# EAGLE design motor_driver (EAGLE 8.6.0)
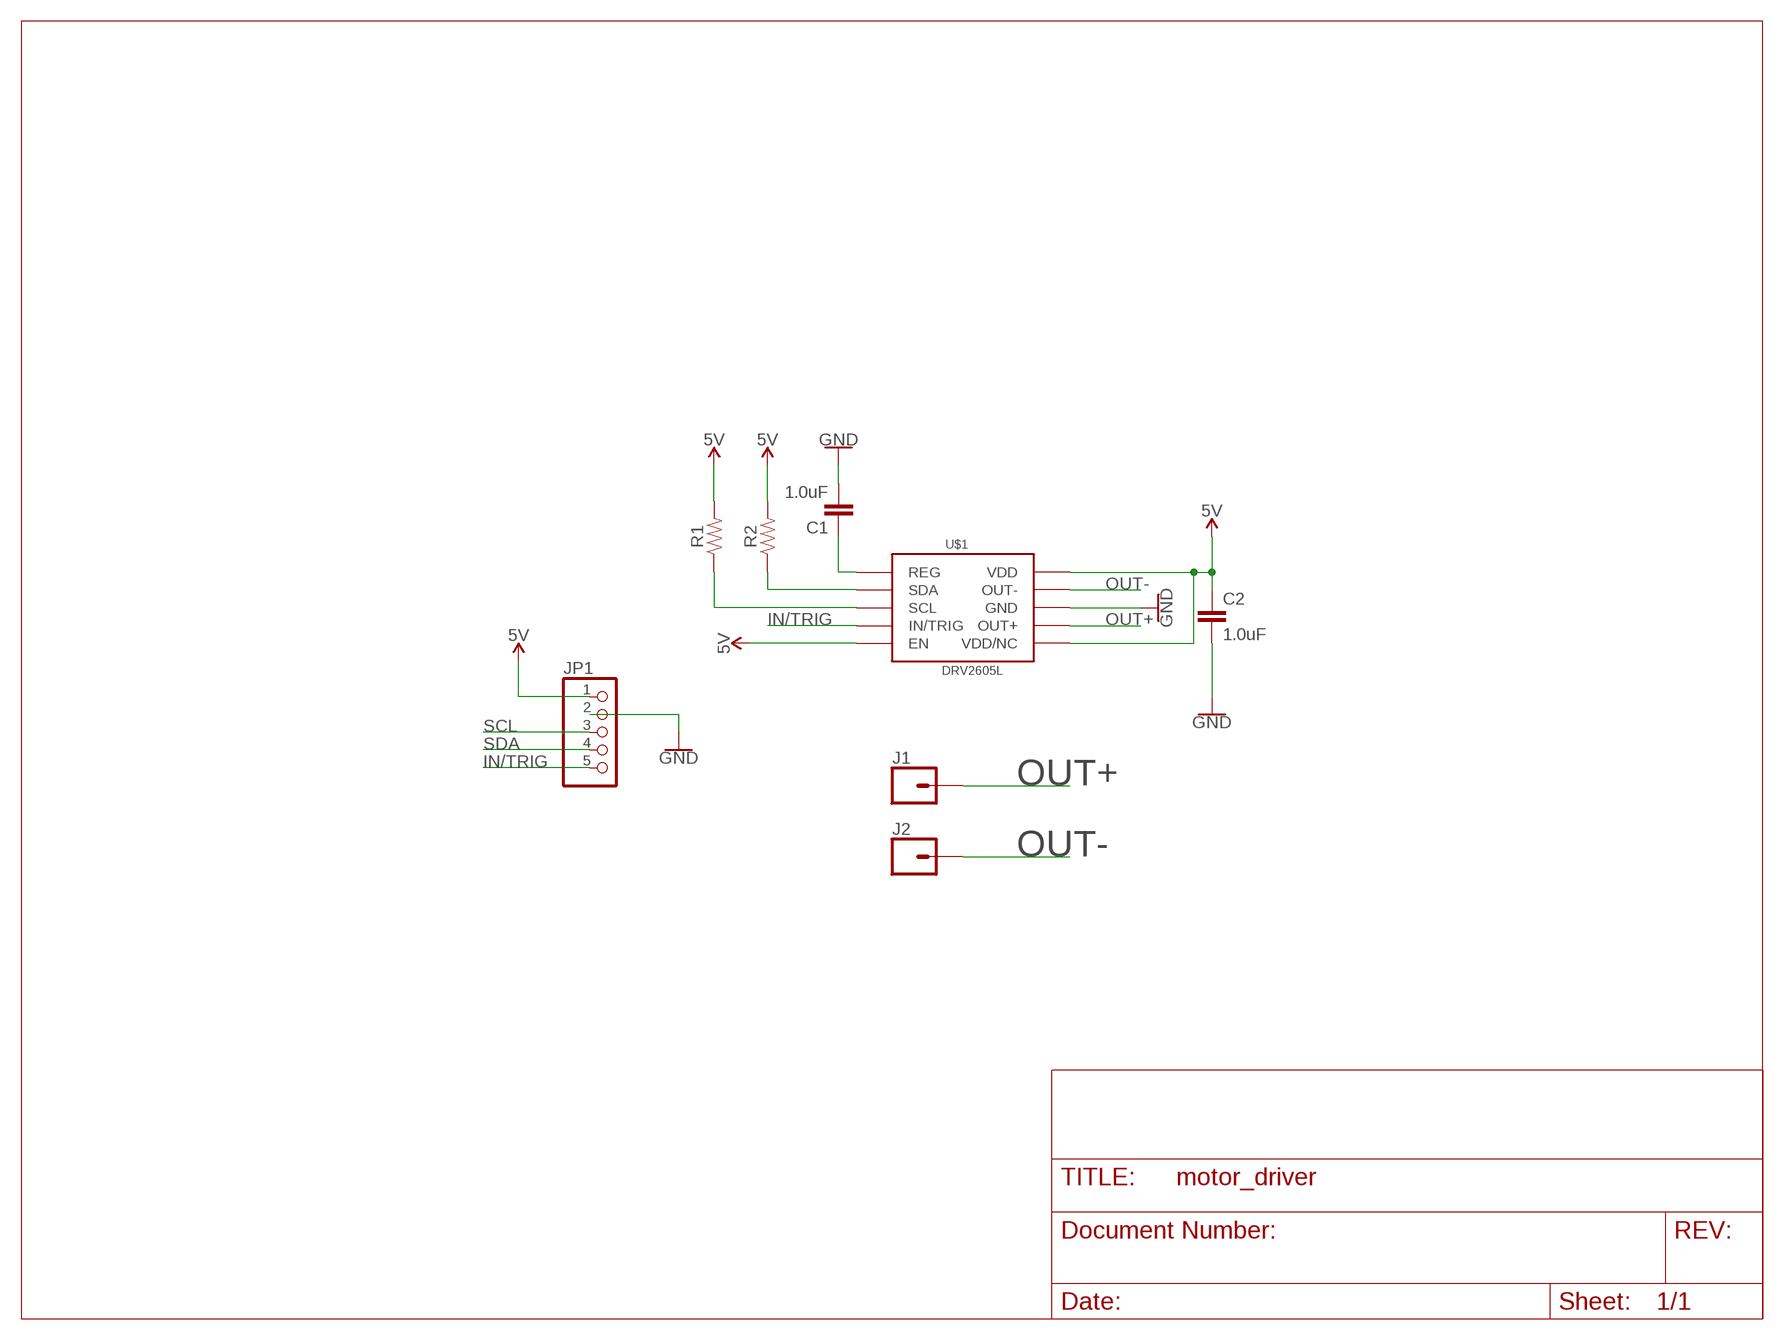
[diagram p0: schematic, sheet 1]

## Parts
C1  1.0uF  1.0UF-0805-25V-(+80/-20%)  [0805]
C2  1.0uF  1.0UF-0805-25V-(+80/-20%)  [0805]
J1  CONN_01OFFSET  [1X01_OFFSET]
J2  CONN_01OFFSET  [1X01_OFFSET]
JP1  PINHD-1X5  [1X05]
R1  RESISTOR0805  [0805]
R2  RESISTOR0805  [0805]
U$1  DRV2605L  [VSSOP-10]

## Nets
5V: C2.1 JP1.1 R1.2 R2.2 U$1.P$5(EN) U$1.P$6(VDD/NC) U$1.P$10(VDD)
GND: C1.2 C2.2 JP1.2 U$1.P$8(GND)
IN/TRIG: JP1.5 U$1.P$4(IN/TRIG)
N$6: C1.1 U$1.P$1(REG)
OUT+: J1.1 U$1.P$7(OUT+)
OUT-: J2.1 U$1.P$9(OUT-)
SCL: JP1.3 R1.1 U$1.P$2(SCL)
SDA: JP1.4 R2.1 U$1.P$3(SDA)

## Library data of the parts
C1 C2 = SparkFun-Capacitors:1.0UF: 1µF ceramic capacitors A capacitor is a passive two-terminal electrical component used to store electrical energy temporarily in an electric field.; PROD_ID: CAP-11625
J1 J2 = SparkFun-Connectors:CONN_01: Single connection point. Often used as Generic Header-pin footprint for 0.1 inch spaced/style header connections On any of the 0.1 inch spaced packages, you can populate with these: Break Away Headers - Straight <https://www.sparkfun.com/products/116> (PRT-00116) Break Away Male Headers - Right Angle <https://www.sparkfun.com/products/553> (PRT-00553) Female Headers <https://www.sparkfun.com/products/115> (PRT-00115) Break Away Headers - Machine Pin <https://www.sparkfun.com/products/117> (PRT-00117) Break Away Female Headers - Swiss Machine Pin <https://www.sparkfun.com/products/743> (PRT-00743) This device is also useful as a general connection point to wire up your design to another part of your project. Our various solder wires solder well into these plated through hole pads. Hook-Up Wire - Assortment (Stranded, 22 AWG) <https://www.sparkfun.com/products/11375> (PRT-11375) Hook-Up Wire - Assortment (Solid Core, 22 AWG) <https://www.sparkfun.com/products/11367> (PRT-11367) View the entire wire category on our website here <https://www.sparkfun.com/categories/141> Special notes: SMTSO-256-ET is a "flush mount" nut for a 4-40 screw. We mostly use this on specialty testbeds; it is a nice way to connect hardware to your PCB at an adjustable hieght. Also note, the SNAP packages are for using a snappable style connector. We sell a baggie of snaps and they are also used on two LilyPad designs: Snap Assortment - 30 pack (male and female) <https://www.sparkfun.com/products/11347> (DEV-11347) LilyPad Arduino SimpleSnap <https://www.sparkfun.com/products/10941> (DEV-10941) LilyPad SimpleSnap Protoboard <https://www.sparkfun.com/products/10940> (DEV-10940)
JP1 = pinhead:PINHD-1X5: PIN HEADER
R1 R2 = SparkFun-Resistors:RESISTOR: Generic Resistor Package
U$1 = SparkFun-IC-Special-Function:DRV2605L; PROD_ID: IC-13504

## Board
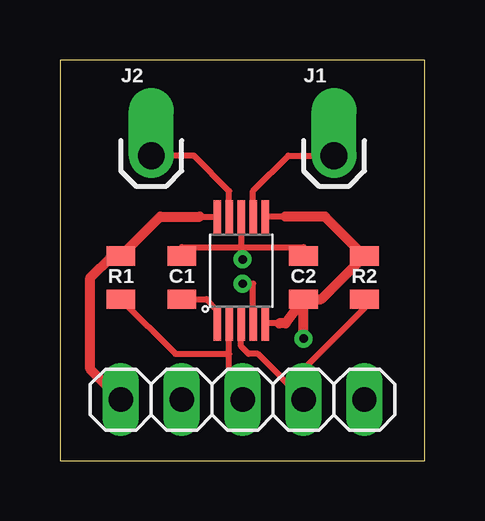
[diagram p1: board, top side]
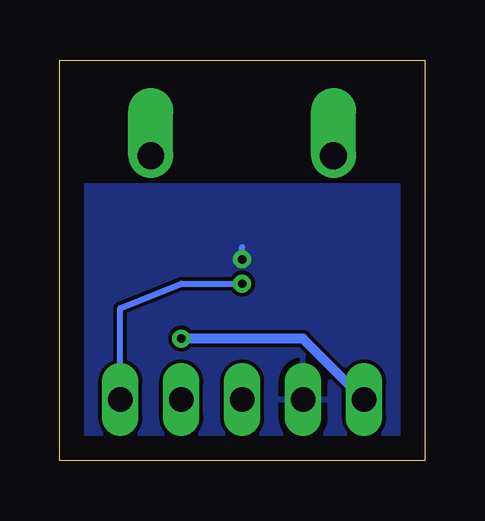
[diagram p2: board, bottom side, seen from below]

Size 15.22 x 16.69 mm. Coordinates in mm from the lower left corner, seen from the top.
Outline: 0,0 15.22,0 15.22,16.69 0,16.69 0,0
Copper layers (1*16): Top 0.035mm / dielectric 1.5mm / Bottom 0.035mm
Design rules "default": minimum track width 6mil, minimum drill 0.35mm, track to track 6mil, track to pad 6mil, pad to pad 6mil, via to via 6mil, smd to smd 6mil, copper to edge 40mil, drill to drill 6mil, minimum pad ring 10mil, minimum via ring 8mil, stop-mask expansion 4mil, vias tented up to drill 0mil, thermal gap 10mil

### Footprints (pad centres in the part's own frame; a part is rotated, then mirrored left to right if it is on the bottom)
0805 = smd 0.8 x 1.2: 1 -0.9,0; 2 0.9,0
1X01_OFFSET = drill 1.118 pad 1.88 offset: 1 0,0
1X05 = drill 1.016 long: 1 -5.08,0; 2 -2.54,0; 3 0,0; 4 2.54,0; 5 5.08,0
VSSOP-10 = smd 1.45 x 0.3: P$1 -1.905,1.06; P$2 -1.905,0.56; P$3 -1.905,0.06; P$4 -1.905,-0.44; P$5 -1.905,-0.94; P$6 2.495,-0.94; P$7 2.495,-0.44; P$8 2.495,0.06; P$9 2.495,0.56; P$10 2.495,1.06

### Placement (x,y rotation side)
C1  5.08,7.62 90 top
C2  10.16,7.62 90 top
J1  11.43,12.7 0 top
J2  3.81,12.7 0 top
JP1  7.62,2.54 0 top
R1  2.54,7.62 90 top
R2  12.7,7.62 90 top
U$1  7.62,7.62 90 top

### Tracks (layer width: path | path; a pad name or v marks a point on that pad's centre or on a via)
5V  (via drill 0.35)
  Top 0.254: 5.84,10.16 6.51,10.16 U$1.P$10 | 9.14,5.71 U$1.P$5 | 9.4,10.16 8.61,10.16 U$1.P$6
  Top 0.406: JP1.1 1.27,3.81 1.27,7.62 2.17,8.52 R1.2 4.18,10.16 5.84,10.16 | v10.16,5.08 C2.1 | C2.1 9.41,5.71 9.14,5.71 | C2.1 10.9,6.72 R2.2 11.06,10.16 9.4,10.16
  Bottom 0.406: JP1.1 5.08,5.08 v10.16,5.08
GND  (via drill 0.35)
  Top 0.254: C1.2 5.08,8.89 7.56,8.89 | C2.2 10.16,8.89 7.56,8.89 | U$1.P$8 7.56,8.89 | 7.56,8.89 7.56,8.38 v7.62,8.38
  Bottom 0.254: v7.62,8.38 7.62,8.89
  pour Bottom: 0,0 0,11.43 15.24,11.43 15.24,0
IN/TRIG  (via drill 0.35)
  Top 0.254: U$1.P$4 8.06,7.37 v7.62,7.37
  Bottom 0.254: JP1.5 12.7,6.35 10.16,7.37 v7.62,7.37
N$6
  Top 0.254: C1.1 6.11,6.72 6.56,6.27 U$1.P$1
OUT+
  Top 0.254: U$1.P$7 8.06,11.23 9.53,12.7 J1.1
OUT-
  Top 0.254: U$1.P$9 7.06,11.23 5.59,12.7 J2.1
SCL
  Top 0.254: JP1.3 7.06,3.1 7.06,4.45 | 7.06,4.45 U$1.P$2 | R1.1 4.82,4.45 7.06,4.45
SDA
  Top 0.254: R2.1 12.7,6.35 10.16,3.81 JP1.4 8.26,4.45 7.87,4.45 7.56,4.76 U$1.P$3